# EAGLE schematic EE-Workshop (EAGLE 9.4.0)
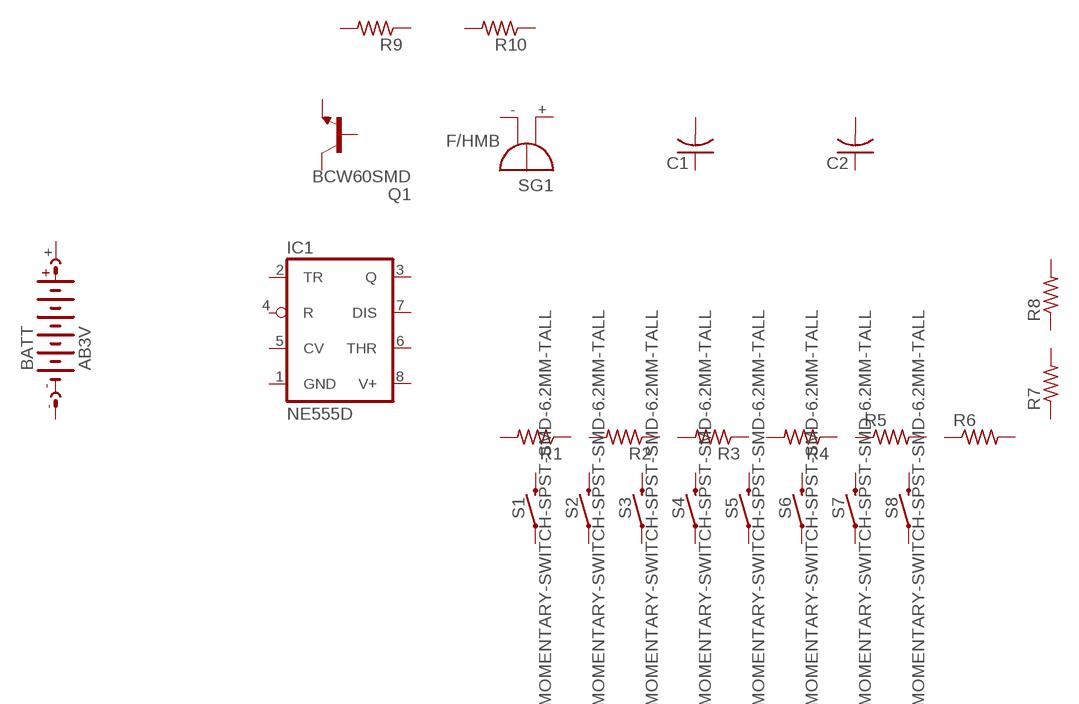
[diagram p0: schematic, sheet 1]

## Parts
BATT  AB3V  AB9V  [AB9V]
C1  C-USC0805  [C0805]
C2  C-USC0805  [C0805]
IC1  NE555D  [SO08]
Q1  BCW60SMD  [SOT23-BEC]
R1  R-US_R0805  [R0805]
R2  R-US_R0805  [R0805]
R3  R-US_R0805  [R0805]
R4  R-US_R0805  [R0805]
R5  R-US_R0805  [R0805]
R6  R-US_R0805  [R0805]
R7  R-US_R0805  [R0805]
R8  R-US_R0805  [R0805]
R9  R-US_R0805  [R0805]
R10  R-US_R0805  [R0805]
S1  MOMENTARY-SWITCH-SPST-SMD-6.2MM-TALL  [TACTILE_SWITCH_SMD_6.2MM_TALL]
S2  MOMENTARY-SWITCH-SPST-SMD-6.2MM-TALL  [TACTILE_SWITCH_SMD_6.2MM_TALL]
S3  MOMENTARY-SWITCH-SPST-SMD-6.2MM-TALL  [TACTILE_SWITCH_SMD_6.2MM_TALL]
S4  MOMENTARY-SWITCH-SPST-SMD-6.2MM-TALL  [TACTILE_SWITCH_SMD_6.2MM_TALL]
S5  MOMENTARY-SWITCH-SPST-SMD-6.2MM-TALL  [TACTILE_SWITCH_SMD_6.2MM_TALL]
S6  MOMENTARY-SWITCH-SPST-SMD-6.2MM-TALL  [TACTILE_SWITCH_SMD_6.2MM_TALL]
S7  MOMENTARY-SWITCH-SPST-SMD-6.2MM-TALL  [TACTILE_SWITCH_SMD_6.2MM_TALL]
S8  MOMENTARY-SWITCH-SPST-SMD-6.2MM-TALL  [TACTILE_SWITCH_SMD_6.2MM_TALL]
SG1  F/HMB  [F/HMB]
Unconnected: BATT.+ BATT.- C1.1 C1.2 C2.1 C2.2 IC1.2(TR) IC1.3(Q) IC1.4(R) IC1.5(CV) IC1.6(THR) IC1.7(DIS) Q1.B Q1.C Q1.E R1.1 R1.2 R2.1 R2.2 R3.1 R3.2 R4.1 R4.2 R5.1 R5.2 R6.1 R6.2 R7.1 R7.2 R8.1 R8.2 R9.1 R9.2 R10.1 R10.2 S1.A2 S1.B2 S2.A2 S2.B2 S3.A2 S3.B2 S4.A2 S4.B2 S5.A2 S5.B2 S6.A2 S6.B2 S7.A2 S7.B2 S8.A2 S8.B2 SG1.+ SG1.-

## Power pins joined to a net without a drawn wire
GND: IC1.1(GND)
V+: IC1.8(V+)

## Library data of the parts
BATT = battery:AB9V: 9-V BATTERY CLIP
C1 C2 = rcl:C-US: CAPACITOR, American symbol; SPICEPREFIX: C
IC1 = linear:*555: TIMER
Q1 = transistor-npn:BCW60*: NPN Transistor
R1-R10 = rcl:R-US_: RESISTOR, American symbol; SPICEPREFIX: R
S1-S8 = SparkFun-Switches:MOMENTARY-SWITCH-SPST: Momentary Switch (Pushbutton) - SPST Normally-open (NO) SPST momentary switches (buttons, pushbuttons). Variants PTH-12MM - 12mm square, through-hole Momentary Pushbutton Switch - 12mm Square <https://www.sparkfun.com/products/9190> (COM-09190) PTH-6.0MM, PTH-6.0MM-KIT - 6.0mm square, through-hole Mini Pushbutton Switch <https://www.sparkfun.com/products/97> (COM-00097) KIT package intended for soldering kit's - only one side of pads' copper is exposed. PTH-RIGHT-ANGLE-KIT - Right-angle, through-hole Right Angle Tactile Button <https://www.sparkfun.com/products/10791> - Used on SparkFun BigTime Watch Kit <https://www.sparkfun.com/products/11734> SMD-12MM - 12mm square, surface-mount Tactile Button - SMD (12mm) <https://www.sparkfun.com/products/12993> (COM-12993) Used on SparkFun PicoBoard <https://www.sparkfun.com/products/11888> SMD-4.5MM - 4.5mm Square Trackball Switch Used on SparkFun Blackberry Trackballer Breakout <https://www.sparkfun.com/products/13169> SMD-4.6MMX2.8MM - 4.60mm x 2.80mm, surface mount Used on SparkFun SAMD21 Mini Breakout <https://www.sparkfun.com/products/13664> SMD-5.2MM, SMD-5.2-REDUNDANT - 5.2mm square, surface-mount Mini Pushbutton Switch - SMD <https://www.sparkfun.com/products/8720> (COM-08720) Used on Arduino Pro Mini <https://www.sparkfun.com/products/11114> REDUNDANT package connects both switch circuits together SMD-6.0X3.5MM - 6.0 x 3.5mm, surface mount Momentary Reset Switch SMD <https://www.sparkfun.com/products/8229> (COM-08229) SMD-6.2MM-TALL - 6.2mm square, surface mount Tactile Button - SMD (6mm) <https://www.sparkfun.com/products/12992> Used on SparkFun Digital Sandbox <https://www.sparkfun.com/products/12651> SMD-RIGHT-ANGLE - Right-angle, surface mount Used on SparkFun Block for Intel® Edison - Arduino <https://www.sparkfun.com/products/13036>; PROD_ID: SWCH-11966; SF_SKU: COM-12992
SG1 = buzzer:F/HMB: BUZZER Source: Buerklin; OC_FARNELL: unknown; OC_NEWARK: unknown